# Altium schematic sheet Optical_Fiber.SchDoc
size A4; SheetNumber: 1; SheetTotal: 1
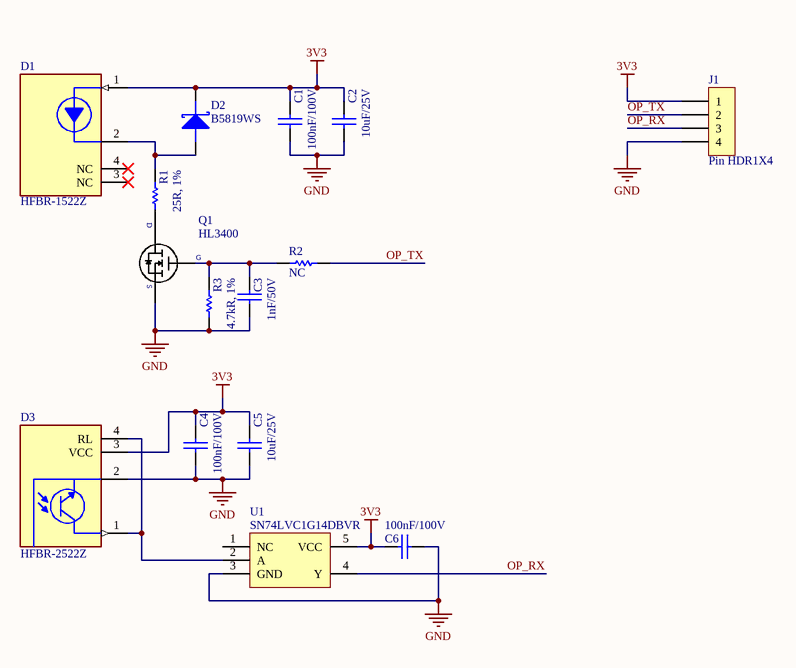
[diagram p0: Optical_Fiber.SchDoc]

## Parts
C1  100nF/100V  [0603C]
C2  10uF/25V  [0603C]
C3  1nF/50V  [0603C]
C4  100nF/100V  [0603C]
C5  10uF/25V  [0603C]
C6  100nF/100V  [0603C]
D1  HFBR-1522Z  [HFBR_1521Z]
D2  B5819WS  [SOD-123]
D3  HFBR-2522Z  [HFBR_2521Z]
J1  Pin HDR1X4  [Pin HDR1X4/2.54mm-W]
Q1  HL3400  [SOT23-3]
R1  25R, 1%  [0603R]
R2  NC  [0603R]
R3  4.7kR, 1%  [0603R]
U1  SN74LVC1G14DBVR  [SOT23-5]

## Nets
3V3: C1.1 C2.1 C4.1 C5.1 C6.1 D1.1(VO) D2.K D3.3(VCC) J1.1 U1.5(VCC)
GND: C1.2 C2.2 C3.1 C4.2 C5.2 C6.2 D3.2(GROUND) J1.4 Q1.2 R3.1 U1.3(GND)
OP_RX: J1.3 U1.4(Y)
OP_TX: J1.2 R2.1
NetC3_2: C3.2 Q1.1 R2.2 R3.2
NetD1_2: D1.2(GROUND) D2.A R1.1
NetD3_1: D3.1(VO) D3.4(RL) U1.2(A)
NetQ1_3: Q1.3 R1.2

Not connected (* = marked no-connect by the designer): D1 3(NC)* 4(NC)*; U1 1(NC)

## Notes on the sheet
- (in symbol NMOS) D; G; S

## Library data of the parts
C1 C4 C6 = CAP: CC0603KRX7R9BB104
C2 C5 = CAP: CC0603MRX5R8BB106
C3 = CAP: CC0603KRX7R9BB102
D1 = HFBR-1521Z: Versatile Link Fiber-Optic Connection; MF: Broadcom Limited; MP: HFBR-2521Z; SnapEDA_Link: https://www.snapeda.com/parts/HFBR-2521Z/Broadcom/view-part/?ref=snap; Package: None; Value: *; Check_prices: https://www.snapeda.com/parts/HFBR-2521Z/Broadcom/view-part/?ref=eda
D2 = DIODE SCHOTTKY
D3 = HFBR-2521Z: Versatile Link Fiber-Optic Connection; MF: Broadcom Limited; SnapEDA_Link: https://www.snapeda.com/parts/HFBR-2521Z/Broadcom/view-part/?ref=snap; Package: None; Value: *; MP: HFBR-2521Z; Check_prices: https://www.snapeda.com/parts/HFBR-2521Z/Broadcom/view-part/?ref=eda
Q1 = NMOS
R1 = RES: RP0603BRD0725RL
R2 = RES
R3 = RES: RC0603FR-074K7L
U1 = SN74LVC1G14DBVR: Y=A\